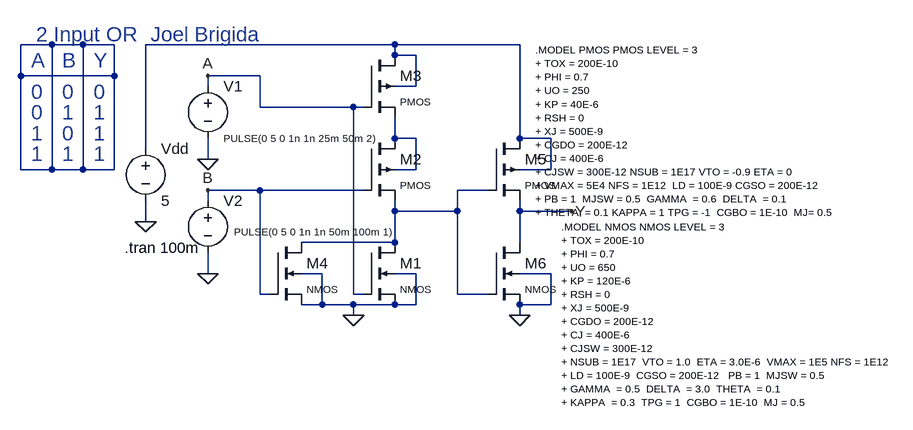
[diagram p0: schematic 2OR.asc]
2OR.asc, the LTspice schematic file:
Version 4
SHEET 1 980 680
WIRE -176 -64 -224 -64
WIRE -128 -64 -176 -64
WIRE -80 -64 -128 -64
WIRE 352 -64 -32 -64
WIRE 544 -64 352 -64
WIRE 352 -48 352 -64
WIRE 384 -48 352 -48
WIRE -224 -16 -224 -64
WIRE -80 -16 -80 -64
WIRE -80 -16 -224 -16
WIRE 144 -16 64 -16
WIRE 64 0 64 -16
WIRE 384 0 384 -48
WIRE 384 0 352 0
WIRE 144 32 144 -16
WIRE 288 32 144 32
WIRE 304 32 288 32
WIRE 352 80 352 48
WIRE 384 80 352 80
WIRE 544 80 544 -64
WIRE 592 80 544 80
WIRE -32 96 -32 -64
WIRE 64 112 64 80
WIRE -224 128 -224 -16
WIRE -176 128 -176 -64
WIRE -176 128 -224 128
WIRE -128 128 -128 -64
WIRE -128 128 -176 128
WIRE -80 128 -80 -16
WIRE -80 128 -128 128
WIRE 384 128 384 80
WIRE 384 128 352 128
WIRE 592 128 592 80
WIRE 592 128 544 128
WIRE 144 160 64 160
WIRE 304 160 144 160
WIRE 496 160 448 160
WIRE 64 176 64 160
WIRE 352 192 352 176
WIRE 448 192 448 160
WIRE 448 192 352 192
WIRE 544 192 544 176
WIRE 624 192 544 192
WIRE -32 208 -32 176
WIRE 352 240 352 192
WIRE 352 240 208 240
WIRE 544 240 544 192
WIRE 64 288 64 256
WIRE 240 288 208 288
WIRE 384 288 352 288
WIRE 592 288 544 288
WIRE 144 320 144 160
WIRE 160 320 144 320
WIRE 288 320 288 32
WIRE 304 320 288 320
WIRE 448 320 448 192
WIRE 496 320 448 320
WIRE 240 336 240 288
WIRE 240 336 208 336
WIRE 288 336 240 336
WIRE 352 336 288 336
WIRE 384 336 384 288
WIRE 384 336 352 336
WIRE 592 336 592 288
WIRE 592 336 544 336
WIRE 288 352 288 336
WIRE 544 352 544 336
FLAG 64 112 0
FLAG 64 288 0
FLAG -32 208 0
FLAG 288 352 0
FLAG 64 -16 A
FLAG 64 160 B
FLAG 544 352 0
FLAG 624 192 Y
SYMBOL nmos4 304 240 R0
WINDOW 3 56 72 Left 1
SYMATTR InstName M1
SYMBOL pmos4 304 80 R0
WINDOW 3 56 72 Left 1
SYMATTR InstName M2
SYMBOL pmos4 304 -48 R0
WINDOW 3 56 72 Left 1
SYMATTR InstName M3
SYMBOL voltage 64 -16 R0
WINDOW 3 24 96 Left 1
WINDOW 123 0 0 Left 0
WINDOW 39 0 0 Left 0
SYMATTR InstName V1
SYMATTR Value PULSE(0 5 0 1n 1n 25m 50m 2)
SYMBOL voltage 64 160 R0
WINDOW 3 40 64 Left 1
WINDOW 123 0 0 Left 0
WINDOW 39 0 0 Left 0
SYMATTR InstName V2
SYMATTR Value PULSE(0 5 0 1n 1n 50m 100m 1)
SYMBOL voltage -32 80 R0
WINDOW 123 0 0 Left 0
WINDOW 39 0 0 Left 0
SYMATTR InstName Vdd
SYMATTR Value 5
SYMBOL nmos4 160 240 R0
WINDOW 3 56 72 Left 1
SYMATTR InstName M4
SYMBOL pmos4 496 80 R0
WINDOW 3 56 72 Left 1
SYMATTR InstName M5
SYMBOL nmos4 496 240 R0
WINDOW 3 56 72 Left 1
SYMATTR InstName M6
TEXT -24 -80 Left 3 ;Joel Brigida
TEXT 608 216 Left 1 !.MODEL NMOS NMOS LEVEL = 3\n+ TOX = 200E-10\n+ PHI = 0.7\n+ UO = 650\n+ KP = 120E-6\n+ RSH = 0\n+ XJ = 500E-9\n+ CGDO = 200E-12\n+ CJ = 400E-6\n+ CJSW = 300E-12\n+ NSUB = 1E17  VTO = 1.0  ETA = 3.0E-6  VMAX = 1E5 NFS = 1E12   \n+ LD = 100E-9  CGSO = 200E-12   PB = 1  MJSW = 0.5\n+ GAMMA  = 0.5  DELTA  = 3.0  THETA  = 0.1\n+ KAPPA  = 0.3  TPG = 1  CGBO = 1E-10  MJ = 0.5
TEXT 568 -56 Left 1 !.MODEL PMOS PMOS LEVEL = 3\n+ TOX = 200E-10\n+ PHI = 0.7\n+ UO = 250 \n+ KP = 40E-6\n+ RSH = 0\n+ XJ = 500E-9 \n+ CGDO = 200E-12 \n+ CJ = 400E-6\n+ CJSW = 300E-12 NSUB = 1E17 VTO = -0.9 ETA = 0\n+ VMAX = 5E4 NFS = 1E12  LD = 100E-9 CGSO = 200E-12\n+ PB = 1  MJSW = 0.5  GAMMA  = 0.6  DELTA  = 0.1\n+ THETA  = 0.1 KAPPA = 1 TPG = -1  CGBO = 1E-10  MJ= 0.5
TEXT -208 -40 Left 3 ;A
TEXT -160 -40 Left 3 ;B
TEXT -112 -40 Left 3 ;Y
TEXT -160 40 Left 3 ;1
TEXT -160 8 Left 3 ;0
TEXT -208 40 Left 3 ;0
TEXT -208 8 Left 3 ;0
TEXT -208 72 Left 3 ;1
TEXT -208 104 Left 3 ;1
TEXT -160 72 Left 3 ;0
TEXT -160 104 Left 3 ;1
TEXT -64 248 Left 2 !.tran 100m
TEXT -112 8 Left 3 ;0
TEXT -112 72 Left 3 ;1
TEXT -112 40 Left 3 ;1
TEXT -112 104 Left 3 ;1
TEXT -200 -80 Left 3 ;2 Input OR

The netlist it stands for:
* 2OR.asc
M1 N004 A 0 0 NMOS
M2 N003 B N004 N003 PMOS
M3 N002 A N003 N002 PMOS
V1 A 0 PULSE(0 5 0 1n 1n 25m 50m 2)
V2 B 0 PULSE(0 5 0 1n 1n 50m 100m 1)
Vdd N002 0 5
M4 N004 B 0 0 NMOS
M5 N002 N004 Y N002 PMOS
M6 Y N004 0 0 NMOS
.model NMOS NMOS
.model PMOS PMOS
.lib standard.mos
* Joel Brigida
.MODEL NMOS NMOS LEVEL = 3
+ TOX = 200E-10
+ PHI = 0.7
+ UO = 650
+ KP = 120E-6
+ RSH = 0
+ XJ = 500E-9
+ CGDO = 200E-12
+ CJ = 400E-6
+ CJSW = 300E-12
+ NSUB = 1E17  VTO = 1.0  ETA = 3.0E-6  VMAX = 1E5 NFS = 1E12
+ LD = 100E-9  CGSO = 200E-12   PB = 1  MJSW = 0.5
+ GAMMA  = 0.5  DELTA  = 3.0  THETA  = 0.1
+ KAPPA  = 0.3  TPG = 1  CGBO = 1E-10  MJ = 0.5
.MODEL PMOS PMOS LEVEL = 3
+ TOX = 200E-10
+ PHI = 0.7
+ UO = 250
+ KP = 40E-6
+ RSH = 0
+ XJ = 500E-9
+ CGDO = 200E-12
+ CJ = 400E-6
+ CJSW = 300E-12 NSUB = 1E17 VTO = -0.9 ETA = 0
+ VMAX = 5E4 NFS = 1E12  LD = 100E-9 CGSO = 200E-12
+ PB = 1  MJSW = 0.5  GAMMA  = 0.6  DELTA  = 0.1
+ THETA  = 0.1 KAPPA = 1 TPG = -1  CGBO = 1E-10  MJ= 0.5
* A
* B
* Y
* 1
* 0
* 0
* 0
* 1
* 1
* 0
* 1
.tran 100m
* 0
* 1
* 1
* 1
* 2 Input OR
.backanno
.end